# EAGLE design NavBoard (EAGLE 8.4.1)
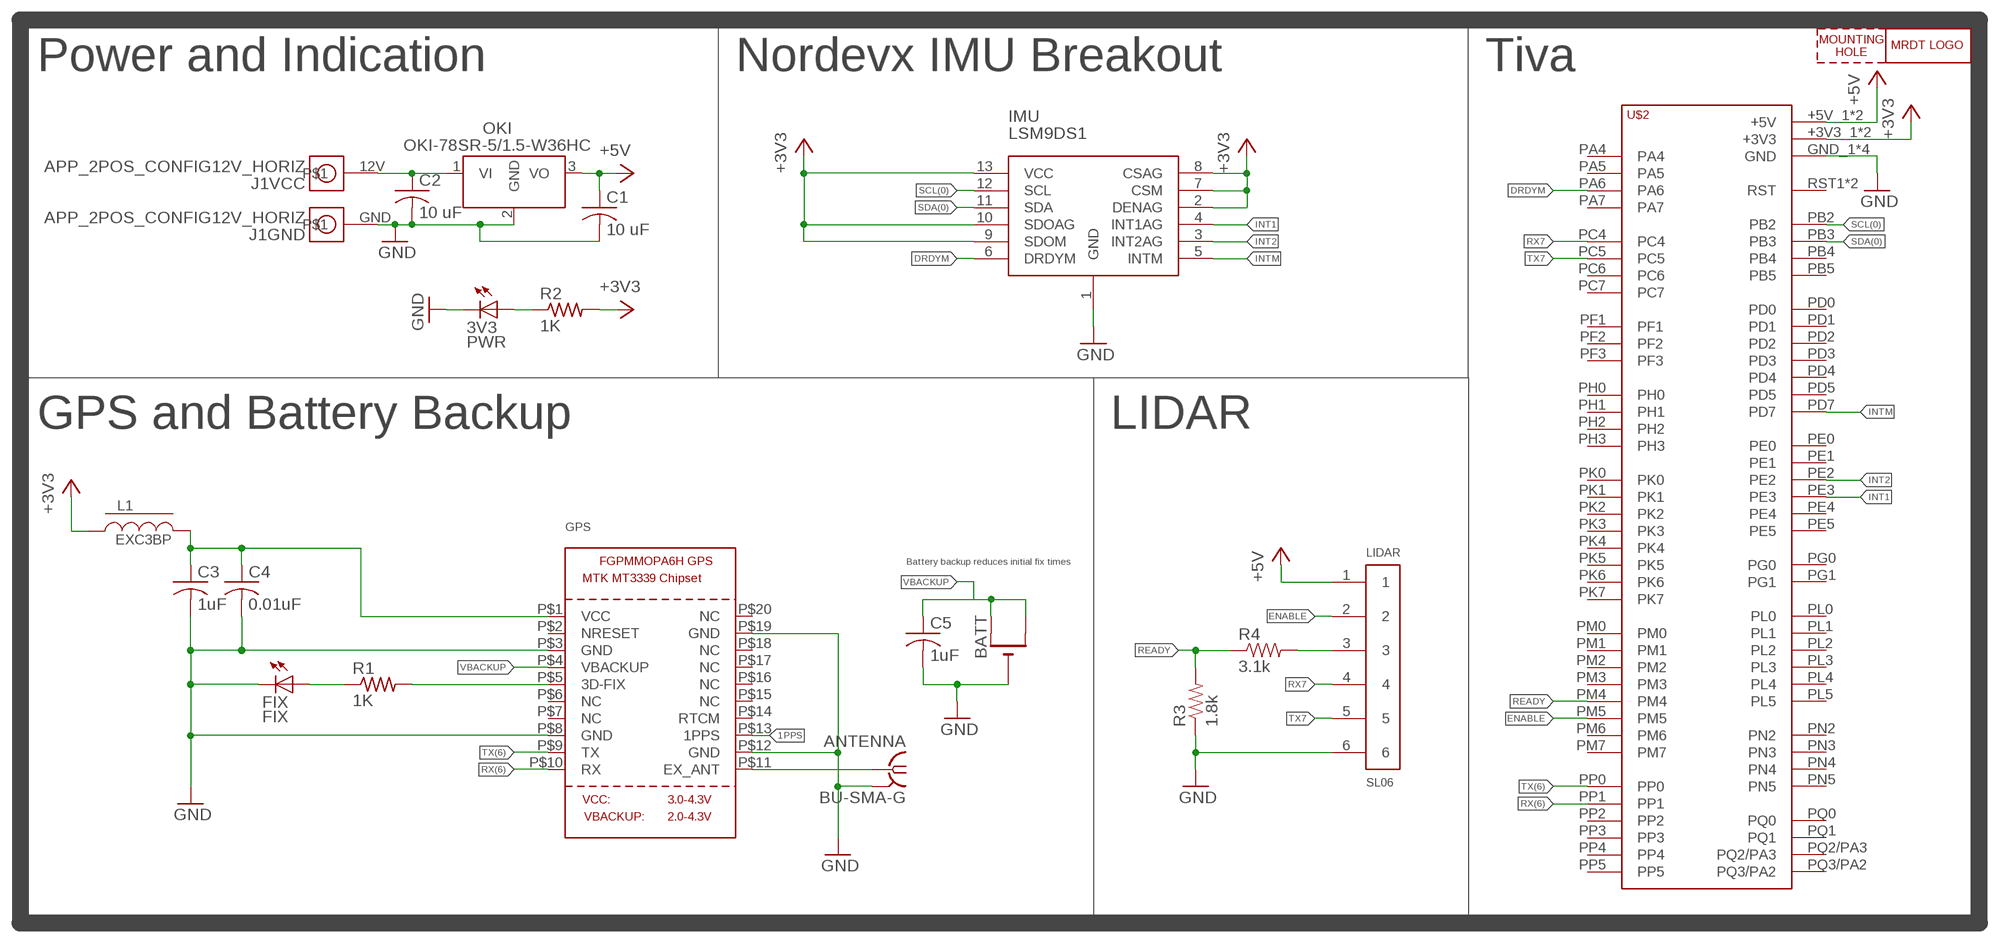
[diagram p0: schematic, sheet 1]

## Parts
3V3  PWR  LEDCHIPLED_0805  [CHIPLED_0805]
ANTENNA  BU-SMA-G  [BU-SMA-G]
BATT  CR1220SMT  [CR1220-SMD]
C1  10 uF  C-USC1206  [C1206]
C2  10 uF  C-USC1206  [C1206]
C3  1uF  C-USC0805  [C0805]
C4  0.01uF  C-USC0805  [C0805]
C5  1uF  C-USC0805  [C0805]
FIX  FIX  LEDCHIPLED_0805  [CHIPLED_0805]
GPS  GPS_FGPMMOPA6H  [FGPMMOPA6H]
H1  MOUNTING_HOLE#6  [#6_SCREW]
IMU  LSM9DS1  [LSM9DS1_BREAKOUT]
J1  APP_2POS_CONFIG12V_HORIZ  [APP45_12V_HORIZ_CONFIG]
L1  EXC3BP  [L0603]
LIDAR  SL06  [MOLEX_SL_06_TH]
LOGO1  MRDT_LOGO  [MRDT_LOGO]
OKI  OKI-78SR-5/1.5-W36HC  [OKI-78SR_HORIZ]
R1  1K  R-US_M0805  [M0805]
R2  1K  R-US_M0805  [M0805]
R3  1.8k  RESISTOR0805-RES  [0805]
R4  3.1k  RESISTOR0805-RES  [0805]
U$2  TIVA-1294  [TIVA-C-CONNECTED]

## Nets
1PPS: GPS.P$13(1PPS)
3V3: C3.1 C4.1 GPS.P$1(VCC) L1.2
12V: C2.1 J1.12V OKI.1(VI)
+3V3: IMU.2(DENAG) IMU.7(CSM) IMU.8(CSAG) IMU.9(SDOM) IMU.10(SDOAG) IMU.13(VCC) L1.1 R2.2 U$2.+3V3_1(+3V3) U$2.+3V3_2(+3V3)
+5V: C1.1 LIDAR.1 OKI.3(VO) U$2.+5V_1(+5V) U$2.+5V_2(+5V)
DRDYM: IMU.6(DRDYM) U$2.PA6
ENABLE: LIDAR.2 U$2.PM5
GND: 3V3.C ANTENNA.2 ANTENNA.3 ANTENNA.4 ANTENNA.5 BATT.- C1.2 C2.2 C3.2 C4.2 C5.2 FIX.C GPS.P$3(GND) GPS.P$8(GND) GPS.P$12(GND) GPS.P$19(GND) IMU.1(GND) J1.GND LIDAR.6 OKI.2(GND) R3.1 U$2.GND_1(GND) U$2.GND_2(GND) U$2.GND_3(GND) U$2.GND_4(GND)
INT1: IMU.4(INT1AG) U$2.PE3
INT2: IMU.3(INT2AG) U$2.PE2
INTM: IMU.5(INTM) U$2.PD7
N$2: FIX.A R1.1
N$3: GPS.P$5(3D-FIX) R1.2
N$4: 3V3.A R2.1
N$5: ANTENNA.1 GPS.P$11(EX_ANT)
N$6: LIDAR.3 R4.2
READY: R3.2 R4.1 U$2.PM4
RX7: LIDAR.4 U$2.PC4
RX(6): GPS.P$10(RX) U$2.PP1
SCL(0): IMU.12(SCL) U$2.PB2
SDA(0): IMU.11(SDA) U$2.PB3
TX7: LIDAR.5 U$2.PC5
TX(6): GPS.P$9(TX) U$2.PP0
VBACKUP: BATT.+$1(+) BATT.+$2(+1) C5.1 GPS.P$4(VBACKUP)
Unconnected: GPS.P$2(NRESET) GPS.P$6(NC) GPS.P$7(NC) GPS.P$14(RTCM) GPS.P$15(NC) GPS.P$16(NC) GPS.P$17(NC) GPS.P$18(NC) GPS.P$20(NC) U$2.PA4 U$2.PA5 U$2.PA7 U$2.PB4 U$2.PB5 U$2.PC6 U$2.PC7 U$2.PD0 U$2.PD1 U$2.PD2 U$2.PD3 U$2.PD4 U$2.PD5 U$2.PE0 U$2.PE1 U$2.PE4 U$2.PE5 U$2.PF1 U$2.PF2 U$2.PF3 U$2.PG0 U$2.PG1 U$2.PH0 U$2.PH1 U$2.PH2 U$2.PH3 U$2.PK0 U$2.PK1 U$2.PK2 U$2.PK3 U$2.PK4 U$2.PK5 U$2.PK6 U$2.PK7 U$2.PL0 U$2.PL1 U$2.PL2 U$2.PL3 U$2.PL4 U$2.PL5 U$2.PM0 U$2.PM1 U$2.PM2 U$2.PM3 U$2.PM6 U$2.PM7 U$2.PN2 U$2.PN3 U$2.PN4 U$2.PN5 U$2.PP2 U$2.PP3 U$2.PP4 U$2.PP5 U$2.PQ0 U$2.PQ1 U$2.PQ2/PA3 U$2.PQ3/PA2 U$2.RST1(RST) U$2.RST_2(RST)

## Notes on the sheet
- Power and Indication | Nordevx IMU Breakout | Tiva
- GPS and Battery Backup | LIDAR
- Battery backup reduces initial fix times

## Library data of the parts
3V3 FIX = adafruit:LED: LED OSRAM: - CHIPLED LG R971, LG N971, LY N971, LG Q971, LY Q971, LO R971, LY R971 LH N974, LH R974 LS Q976, LO Q976, LY Q976 LO Q996 - Hyper CHIPLED LW Q18S LB Q993, LB Q99A, LB R99A - SideLED LS A670, LO A670, LY A670, LG A670, LP A670 LB A673, LV A673, LT A673, LW A673 LH A674 LY A675 LS A676, LA A676, LO A676, LY A676, LW A676 LS A679, LY A679, LG A679 - Hyper Micro SIDELED® LS Y876, LA Y876, LO Y876, LY Y876 LT Y87S - SmartLED LW L88C, LW L88S LB L89C, LB L89S, LG L890 LS L89K, LO L89K, LY L89K LS L896, LA L896, LO L896, LY L896 - TOPLED LS T670, LO T670, LY T670, LG T670, LP T670 LSG T670, LSP T670, LSY T670, LOP T670, LYG T670 LG T671, LOG T671, LSG T671 LB T673, LV T673, LT T673, LW T673 LH T674 LS T676, LA T676, LO T676, LY T676, LB T676, LH T676, LSB T676, LW T676 LB T67C, LV T67C, LT T67C, LS T67K, LO T67K, LY T67K, LW E67C LS E67B, LA E67B, LO E67B, LY E67B, LB E67C, LV E67C, LT E67C LW T67C LS T679, LY T679, LG T679 LS T770, LO T770, LY T770, LG T770, LP T770 LB T773, LV T773, LT T773, LW T773 LH T774 LS E675, LA E675, LY E675, LS T675 LS T776, LA T776, LO T776, LY T776, LB T776 LHGB T686 LT T68C, LB T68C - Hyper Mini TOPLED® LB M676 - Mini TOPLED Santana® LG M470 LS M47K, LO M47K, LY M47K Source: http://www.osram.convergy.de/
ANTENNA = con-coax:BU-SMA-G: FEMALE SMA CONNECTOR Radiall distributor RS 193-9117; OC_FARNELL: unknown; OC_NEWARK: unknown
BATT = adafruit:CR1220: CR1216/CR1220/CR1225 12mm 3V lithium coin cell Great for battery packup. Both SMT and THM holders. Note the THM package has the ground pads on both sides of the PCB so that the masks are the same - this reduces the cost
C1-C5 = resistor:C-US: CAPACITOR, American symbol
GPS = adafruit:GPS_FGPMMOPA6H: GPS Module - MTK MT3339 Chipset, -165dBm sensitivity, 22 channels, 10Hz, auto-select external antenna options
H1 = MRDT-Hardware:MOUNTING_HOLE: Mounting hole for M6 bolt. Standard use mounting hole for: Tiva C Connected - M6 Anderson Powerpole Mounting Wing - M8 Most frame-mounted PCB's - M8
IMU = MRDT-Sensors:LSM9DS1
J1 = MRDT-Connectors:APP_2POS_CONFIG; COLOR1: YELLOW; COLOR2: BLACK
L1 = ferrite:EXC3BP: Chip Bead Core
LIDAR = MRDT-Connectors:SL06
LOGO1 = MRDT-Hardware:MRDT_LOGO
OKI = MRDT-ICs:OKI-78SR-*/1.5-W36?C: 4.95W DC/DC Converter Manufacturer: Murata; VOUT: +5v
R1 R2 = adafruit:R-US_: RESISTOR, American symbol
R3 R4 = SparkFun-Resistors:RESISTOR: Resistor Basic schematic elements and footprints for 0603, 1206, and PTH resistors.
U$2 = MRDT-Microcontrollers:TIVA-1294: TIVA C CONNECTED LAUNCHPAD

## Board
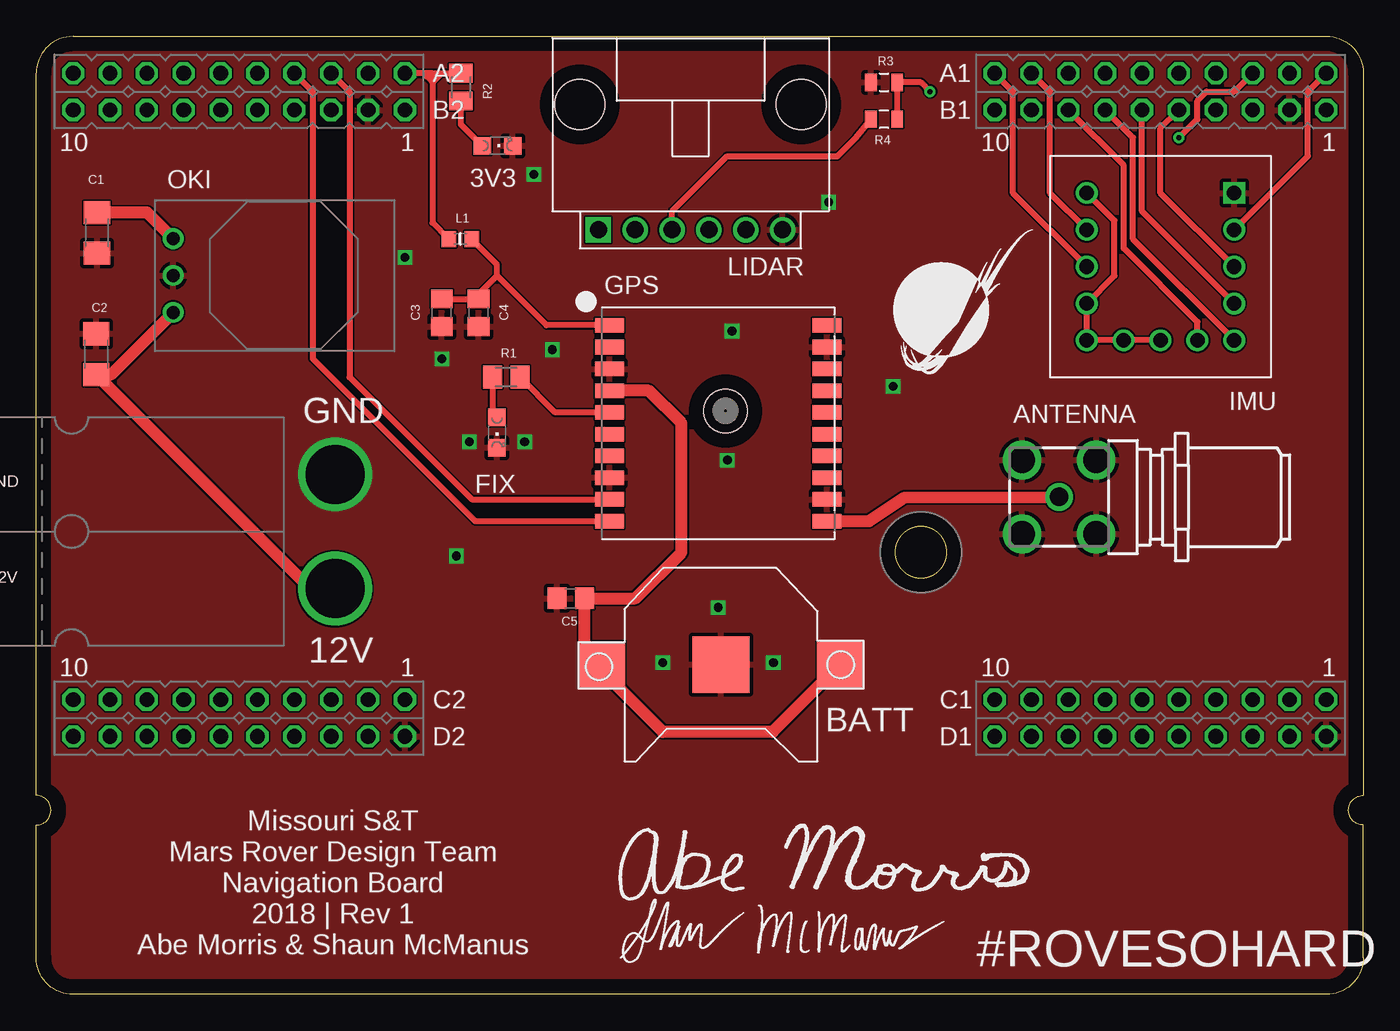
[diagram p1: board, top side]
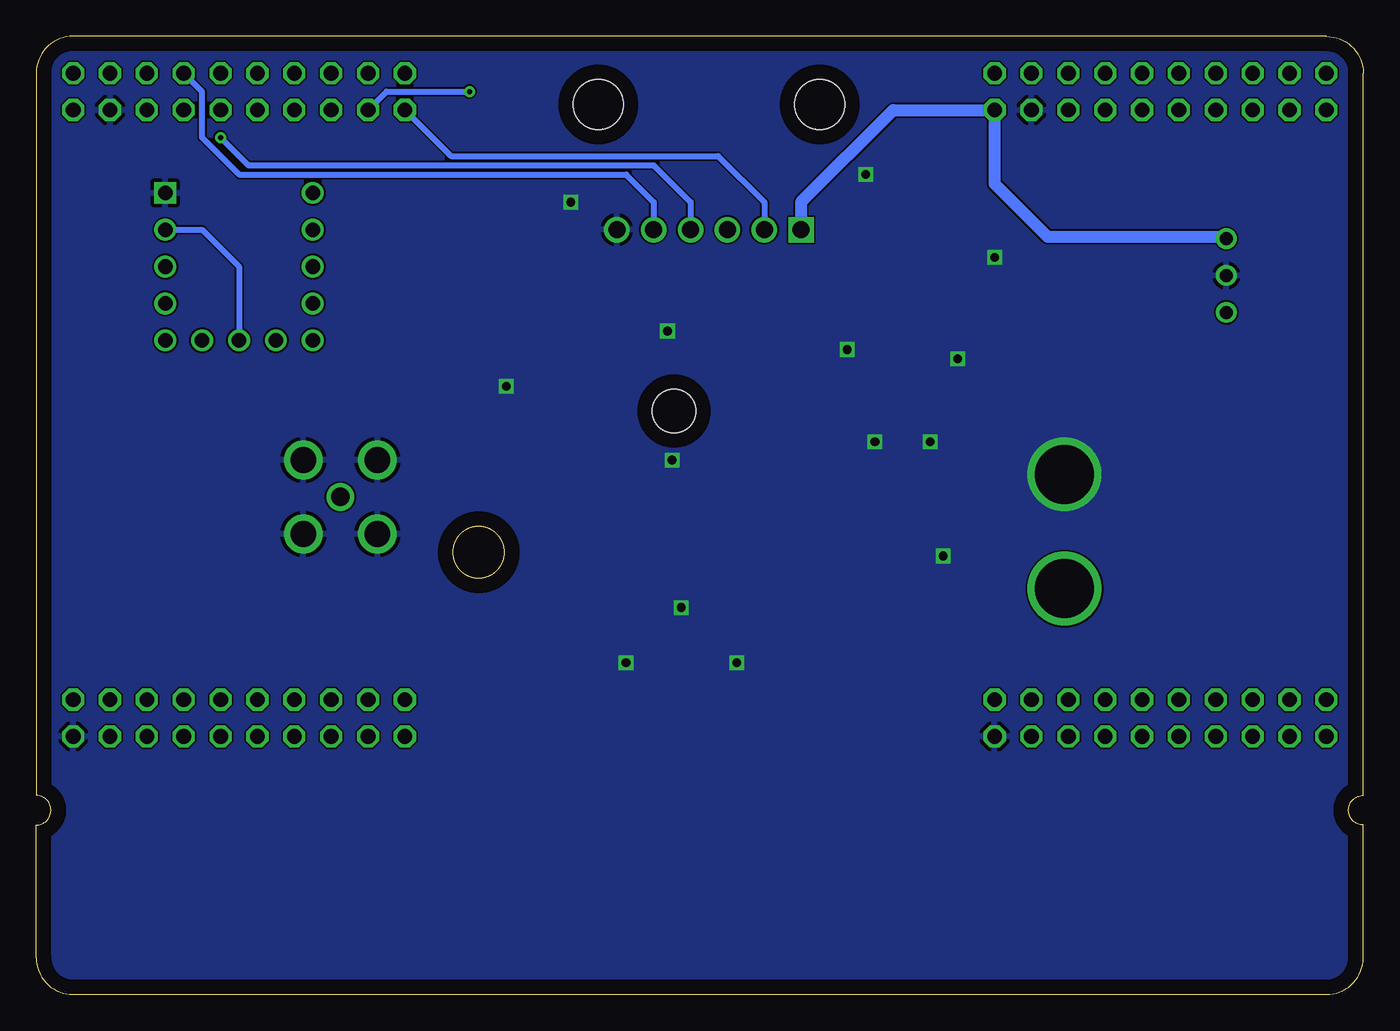
[diagram p2: board, bottom side, seen from below]

Size 91.44 x 66.04 mm. Coordinates in mm from the lower left corner, seen from the top.
Outline: 2.54,66.03 arc90 0,63.49
Outline: 2.54,66.04 88.9,66.04 arc-90 91.44,63.5 91.44,13.72 arc180 91.44,11.68 91.44,2.54 arc-90 88.9,0 2.54,0 arc-90 0,2.54 0,11.68 arc180 0,13.72 0,63.5
Copper layers (1*16): Top 0.035mm / dielectric 1.5mm / Bottom 0.035mm
Design rules "advanced_circuits_standard": minimum track width 5mil, minimum drill 10mil, track to track 5mil, track to pad 5mil, pad to pad 5mil, via to via 5mil, smd to smd 5mil, copper to edge 40mil, drill to drill 5mil, minimum pad ring 10mil, minimum via ring 8mil, stop-mask expansion 4mil, vias tented up to drill 0mil, thermal gap 10mil

### Footprints (pad centres in the part's own frame; a part is rotated, then mirrored left to right if it is on the bottom)
CHIPLED_0805 = smd 1.2 x 1.2: A 0,-1.05; C 0,1.05
BU-SMA-G = drill 1.27: 1 0,0 | drill 1.778: 2 -2.55,2.55; 3 2.55,2.55; 4 2.55,-2.55; 5 -2.55,-2.55
CR1220-SMD = smd 3.2 x 3.2: +$1 -8.2,0; +$2 8.2,0 | smd 3.9 x 3.9: - 0,0
C1206 = smd 1.6 x 1.8: 1 -1.4,0; 2 1.4,0
C0805 = smd 1.3 x 1.5: 1 -0.95,0; 2 0.95,0
FGPMMOPA6H = smd 2 x 1: P$1 -7.5,6.75; P$2 -7.5,5.25; P$3 -7.5,3.75; P$4 -7.5,2.25; P$5 -7.5,0.75; P$6 -7.5,-0.75; P$7 -7.5,-2.25; P$8 -7.5,-3.75; P$9 -7.5,-5.25; P$10 -7.5,-6.75; P$11 7.5,-6.75; P$12 7.5,-5.25; P$13 7.5,-3.75; P$14 7.5,-2.25; P$15 7.5,-0.75; P$16 7.5,0.75; P$17 7.5,2.25; P$18 7.5,3.75; P$19 7.5,5.25; P$20 7.5,6.75 | hole 3: 0.5,0.85
LSM9DS1_BREAKOUT = drill 1 square: 1 5.08,5.08 | drill 1: 2 5.08,2.54; 3 5.08,0; 4 5.08,-2.54; 5 5.08,-5.08; 6 2.54,-5.08; 7 0,-5.08; 8 -2.54,-5.08; 9 -5.08,-5.08; 10 -5.08,-2.54; 11 -5.08,0; 12 -5.08,2.54; 13 -5.08,5.08
APP45_12V_HORIZ_CONFIG = drill 4.064: 12V 28.194,3.937; GND 28.194,11.811
L0603 = smd 1 x 1.1: 1 -0.794,0; 2 0.794,0
MOLEX_SL_06_TH = drill 1.168 square: 1 -6.35,0 | drill 1.168: 2 -3.81,0; 3 -1.27,0; 4 1.27,0; 5 3.81,0; 6 6.35,0 | hole 3.454: -7.62,8.636; 7.62,8.636
OKI-78SR_HORIZ = drill 0.9 pad 1.422: 1 0,0; 2 -2.54,0; 3 -5.08,0
M0805 = smd 1.3 x 1.6: 1 -0.95,0; 2 0.95,0
0805 = smd 0.8 x 1.2: 1 -0.9,0; 2 0.9,0
TIVA-C-CONNECTED = drill 1.016 octagon: +3V3_1 59.69,54.61; +3V3_2 123.19,54.61; +5V_1 59.69,52.07; +5V_2 123.19,52.07; GND_1 57.15,52.07; GND_2 59.69,8.89; GND_3 120.65,52.07; GND_4 123.19,8.89; PA4 39.37,52.07; PA5 36.83,52.07; PA6 105.41,52.07; PA7 52.07,8.89; PB2 102.87,54.61; PB3 100.33,54.61; PB4 54.61,52.07; PB5 52.07,52.07; PC4 118.11,54.61; PC5 115.57,54.61; PC6 113.03,54.61; PC7 105.41,54.61; PD0 107.95,8.89; PD1 110.49,8.89; PD2 57.15,54.61; PD3 107.95,54.61; PD4 49.53,54.61; PD5 46.99,54.61; PD7 107.95,52.07; PE0 118.11,52.07; PE1 115.57,52.07; PE2 113.03,52.07; PE3 110.49,52.07; PE4 120.65,54.61; PE5 110.49,54.61; PF1 123.19,11.43; PF2 120.65,11.43; PF3 118.11,11.43; PG0 115.57,11.43; PG1 59.69,11.43; PH0 44.45,11.43; PH1 41.91,11.43; PH2 118.11,8.89; PH3 115.57,8.89; PK0 49.53,52.07; PK1 46.99,52.07; PK2 44.45,52.07; PK3 41.91,52.07; PK4 57.15,11.43; PK5 54.61,11.43; PK6 39.37,11.43; PK7 36.83,11.43; PL0 107.95,11.43; PL1 105.41,11.43; PL2 102.87,11.43; PL3 100.33,11.43; PL4 113.03,11.43; PL5 110.49,11.43; PM0 52.07,11.43; PM1 49.53,11.43; PM2 46.99,11.43; PM3 120.65,8.89; PM4 102.87,52.07; PM5 100.33,52.07; PM6 36.83,8.89; PM7 57.15,8.89; PN2 105.41,8.89; PN3 102.87,8.89; PN4 36.83,54.61; PN5 39.37,54.61; PP0 54.61,54.61; PP1 52.07,54.61; PP2 100.33,8.89; PP3 41.91,8.89; PP4 41.91,54.61; PP5 54.61,8.89; PQ0 44.45,54.61; PQ1 39.37,8.89; PQ2/PA3 46.99,8.89; PQ3/PA2 44.45,8.89; RST1 49.53,8.89; RST_2 113.03,8.89

### Placement (x,y rotation side)
3V3  31.78,58.5 270 top
ANTENNA  70.48,34.29 0 top
BATT  47.18,22.73 180 top
C1  4.19,52.49 270 top
C2  4.13,44.13 90 top
C3  27.94,46.99 270 top
C4  30.48,46.99 270 top
C5  36.83,27.3 180 top
FIX  31.75,38.73 180 top
GPS  46.99,39.37 0 top
H1  60.96,30.48 0 top
IMU  77.47,50.16 0 top
J1  -7.6,24.04 0 top
L1  29.21,52.07 0 top
LIDAR  45.09,52.7 0 top
LOGO1  59.05,41.91 0 top
OKI  9.44,47.01 270 top
R1  32.38,42.55 0 top
R2  29.26,62.53 90 top
R3  58.42,62.87 0 top
R4  58.42,60.33 180 top
U$1  [ABE_MORRIS_SIGNATURE]  39.37,5.72 0 top
U$2  -34.29,8.89 0 top
U$3  [SHAUN_MCMANUS_SIGNATURE]  39.37,1.27 0 top

### Tracks (layer width: path | path; a pad name or v marks a point on that pad's centre or on a via)
3V3
  Top 0.406: L1.2 31.75,50.29 31.75,49.53 | C3.1 C4.1 30.48,48.26 31.75,49.53 | GPS.P$1 35.16,46.12 31.75,49.53
12V
  Top 0.813: J1.12V 18.88,27.98 C2.1 5.16,42.73 OKI.1
+3V3
  Top 0.406: 27.3,63.49 26.67,63.49 | 26.67,63.49 U$2.+3V3_1 | 27.3,63.49 27.94,63.49 | 27.94,63.49 R2.2 | L1.1 27.3,53.18 27.3,62.87 | 27.3,62.87 27.3,63.49 | 27.94,63.49 27.31,62.87 27.3,62.87 | 26.67,63.49 27.3,62.87 | IMU.2 87.63,57.79 87.63,62.23 U$2.+3V3_2 | IMU.7 IMU.8 IMU.9 IMU.10 74.3,49.53 74.3,53.34 IMU.13
  Bottom 0.406: IMU.2 80.01,52.7 77.47,50.16 IMU.7
+5V
  Top 0.813: OKI.3 7.64,53.89 C1.1
  Bottom 0.813: LIDAR.1 38.73,54.61 32.38,60.96 U$2.+5V_1 25.4,55.88 21.75,52.23 9.58,52.23 OKI.3
DRDYM
  Top 0.406: IMU.6 80.01,46.36 74.93,51.44 74.93,57.15 U$2.PA6
ENABLE
  Bottom 0.406: U$2.PM5 62.86,57.79 44.45,57.79 41.27,54.61 LIDAR.2
GND  (via drill 0.6)
  other vias: 46.99,26.67 33.66,38.1 35.56,44.45 34.29,56.52 59.05,41.91 47.62,36.83 28.96,30.23 27.94,43.81 47.94,45.72 54.61,54.61 29.84,38.1 50.8,22.86 43.18,22.86 25.4,50.8
  pour Bottom: -1.27,-1.27 -1.27,67.31 92.71,67.31 92.71,-1.27
  pour Top: -2.29,-3.3 -2.29,68.58 93.98,68.58 93.98,-3.3
INT1
  Top 0.406: IMU.4 76.2,53.98 U$2.PE3
INT2
  Top 0.406: IMU.3 77.47,55.24 77.47,59.69 U$2.PE2
INTM
  Top 0.406: IMU.5 75.56,52.07 75.56,59.05 U$2.PD7
N$2
  Top 0.406: R1.1 31.44,40.1 FIX.A
N$3
  Top 0.406: GPS.P$5 35.76,40.12 R1.2
N$4
  Top 0.406: 3V3.A 29.26,59.96 R2.1
N$5
  Top 0.813: ANTENNA.1 59.84,34.25 57.38,32.62 GPS.P$11
N$6
  Top 0.406: R4.2 56.49,59.05 55.2,57.76 47.6,57.76 43.81,53.98 LIDAR.3
READY  (via drill 0.35)
  Top 0.406: R4.1 R3.2 60.96,62.87 v61.59,62.23
  Bottom 0.406: U$2.PM4 67.31,62.23 v61.59,62.23
RX7  (via drill 0.35)
  Top 0.406: v78.74,59.05 80.01,60.33 80.01,61.6 80.65,62.23 82.55,62.23 U$2.PC4
  Bottom 0.406: v78.74,59.05 76.84,57.15 48.89,57.15 46.35,54.61 LIDAR.4
RX(6)
  Top 0.406: U$2.PP1 19.05,62.23 19.05,43.81 30.24,32.62 GPS.P$10
SCL(0)
  Top 0.406: IMU.12 69.85,55.24 69.85,62.23 U$2.PB2
SDA(0)
  Top 0.406: IMU.11 67.31,55.24 67.31,62.23 U$2.PB3
TX7
  Bottom 0.406: U$2.PC5 80.01,62.23 80.01,59.05 77.47,56.52 50.8,56.52 48.89,54.61 LIDAR.5
TX(6)
  Top 0.406: U$2.PP0 21.59,62.23 21.59,42.55 30.02,34.12 GPS.P$9
VBACKUP
  Top 0.813: GPS.P$4 42.2,41.62 44.45,39.37 44.45,30.48 41.27,27.3 C5.1 37.78,23.93 BATT.+$2 | BATT.+$1 50.74,18.1 43.18,18.1 38.98,22.3 BATT.+$2 | BATT.+$2 38.85,22.86 38.42,22.86

### Text on the board
tPlace: GND | 12V | Missouri S&T / Mars Rover Design Team / Navigation Board / 2018 | Rev 1 / Abe Morris & Shaun McManus
tNames: #ROVESOHARD